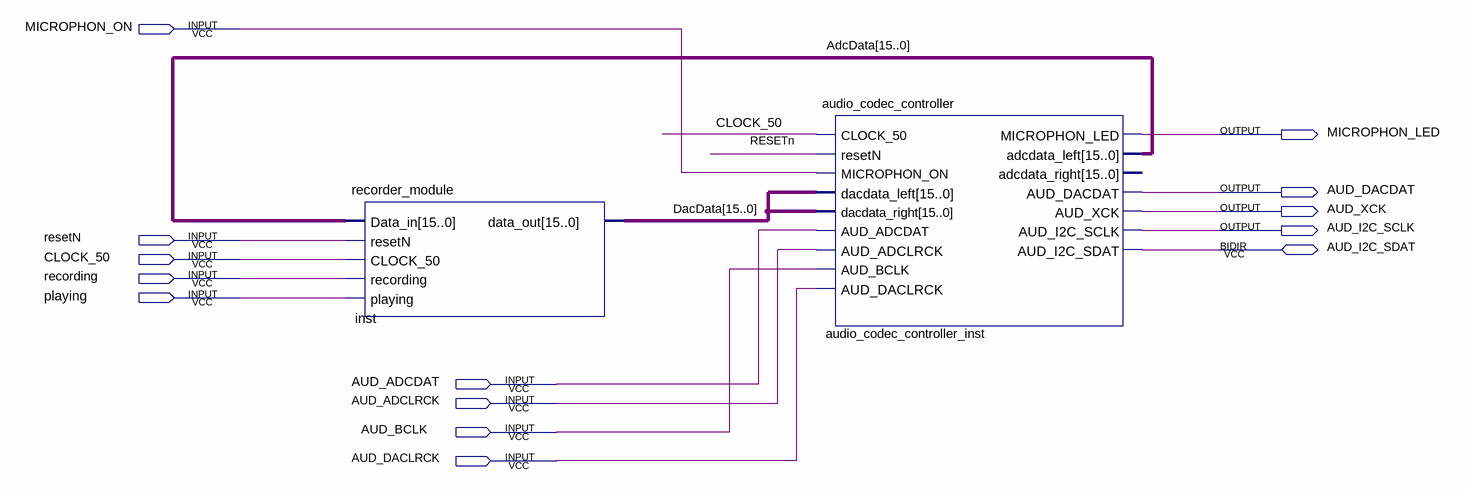
[diagram p0: schematic sheet]
// Quartus schematic experiment_digital_recorder.bdf as structural Verilog: 2 symbols, 14 pins
module experiment_digital_recorder (
  input  MICROPHON_ON,
  input  resetN,
  input  CLOCK_50,
  input  recording,
  input  playing,
  input  AUD_ADCDAT,
  input  AUD_ADCLRCK,
  input  AUD_BCLK,
  input  AUD_DACLRCK,
  inout  AUD_I2C_SDAT,
  output MICROPHON_LED,
  output AUD_DACDAT,
  output AUD_XCK,
  output AUD_I2C_SCLK
);

  wire [15:0] AdcData, DacData;

  recorder_module inst (
    .Data_in(AdcData), .resetN(resetN), .CLOCK_50(CLOCK_50), .recording(recording), .playing(playing),
    .data_out(DacData));
  audio_codec_controller audio_codec_controller_inst (
    .CLOCK_50(CLOCK_50), .resetN(resetN), .MICROPHON_ON(MICROPHON_ON), .dacdata_left(DacData),
    .dacdata_right(DacData), .AUD_ADCDAT(AUD_ADCDAT), .AUD_ADCLRCK(AUD_ADCLRCK), .AUD_BCLK(AUD_BCLK),
    .AUD_DACLRCK(AUD_DACLRCK), .MICROPHON_LED(MICROPHON_LED), .adcdata_left(AdcData),
    .AUD_DACDAT(AUD_DACDAT), .AUD_XCK(AUD_XCK), .AUD_I2C_SCLK(AUD_I2C_SCLK), .AUD_I2C_SDAT(AUD_I2C_SDAT));  // open: adcdata_right
endmodule
